# EAGLE design led-strip (EAGLE 5.07)
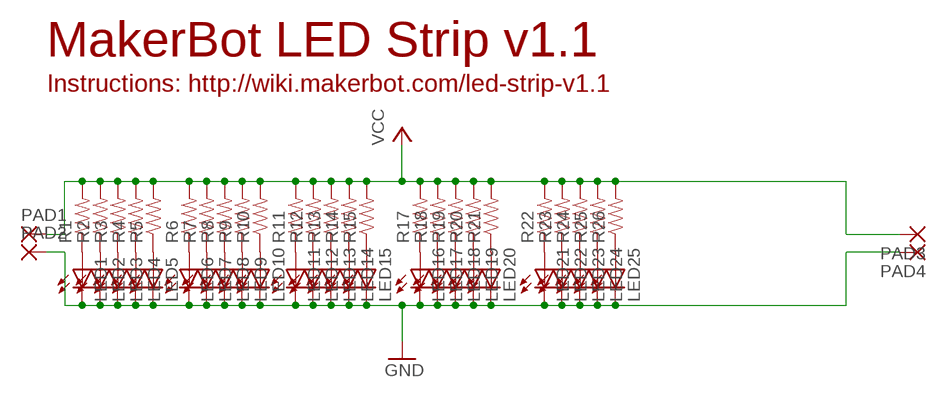
[diagram p0: schematic, sheet 1]

## Parts
LED1  LED1206  [LED-1206]
LED2  LED1206  [LED-1206]
LED3  LED1206  [LED-1206]
LED4  LED1206  [LED-1206]
LED5  LED1206  [LED-1206]
LED6  LED1206  [LED-1206]
LED7  LED1206  [LED-1206]
LED8  LED1206  [LED-1206]
LED9  LED1206  [LED-1206]
LED10  LED1206  [LED-1206]
LED11  LED1206  [LED-1206]
LED12  LED1206  [LED-1206]
LED13  LED1206  [LED-1206]
LED14  LED1206  [LED-1206]
LED15  LED1206  [LED-1206]
LED16  LED1206  [LED-1206]
LED17  LED1206  [LED-1206]
LED18  LED1206  [LED-1206]
LED19  LED1206  [LED-1206]
LED20  LED1206  [LED-1206]
LED21  LED1206  [LED-1206]
LED22  LED1206  [LED-1206]
LED23  LED1206  [LED-1206]
LED24  LED1206  [LED-1206]
LED25  LED1206  [LED-1206]
PAD1  SMD2  [SMD1,27-2,54]
PAD2  SMD2  [SMD1,27-2,54]
PAD3  SMD2  [SMD1,27-2,54]
PAD4  SMD2  [SMD1,27-2,54]
R1  RESISTOR1206  [1206]
R2  RESISTOR1206  [1206]
R3  RESISTOR1206  [1206]
R4  RESISTOR1206  [1206]
R5  RESISTOR1206  [1206]
R6  RESISTOR1206  [1206]
R7  RESISTOR1206  [1206]
R8  RESISTOR1206  [1206]
R9  RESISTOR1206  [1206]
R10  RESISTOR1206  [1206]
R11  RESISTOR1206  [1206]
R12  RESISTOR1206  [1206]
R13  RESISTOR1206  [1206]
R14  RESISTOR1206  [1206]
R15  RESISTOR1206  [1206]
R17  RESISTOR1206  [1206]
R18  RESISTOR1206  [1206]
R19  RESISTOR1206  [1206]
R20  RESISTOR1206  [1206]
R21  RESISTOR1206  [1206]
R22  RESISTOR1206  [1206]
R23  RESISTOR1206  [1206]
R24  RESISTOR1206  [1206]
R25  RESISTOR1206  [1206]
R26  RESISTOR1206  [1206]

## Nets
GND: LED1.C LED2.C LED3.C LED4.C LED5.C LED6.C LED7.C LED8.C LED9.C LED10.C LED11.C LED12.C LED13.C LED14.C LED15.C LED16.C LED17.C LED18.C LED19.C LED20.C LED21.C LED22.C LED23.C LED24.C LED25.C PAD2.1(P) PAD4.1(P)
N$1: LED1.A R1.1
N$2: LED2.A R2.1
N$3: LED3.A R3.1
N$4: LED4.A R4.1
N$5: LED5.A R5.1
N$6: LED6.A R6.1
N$7: LED7.A R7.1
N$8: LED8.A R8.1
N$9: LED9.A R9.1
N$10: LED10.A R10.1
N$11: LED11.A R11.1
N$12: LED12.A R12.1
N$13: LED13.A R13.1
N$14: LED14.A R14.1
N$15: LED15.A R15.1
N$16: LED16.A R17.1
N$17: LED17.A R18.1
N$18: LED18.A R19.1
N$19: LED19.A R20.1
N$20: LED20.A R21.1
N$21: LED21.A R22.1
N$22: LED22.A R23.1
N$23: LED23.A R24.1
N$24: LED24.A R25.1
N$25: LED25.A R26.1
VCC: PAD1.1(P) PAD3.1(P) R1.2 R2.2 R3.2 R4.2 R5.2 R6.2 R7.2 R8.2 R9.2 R10.2 R11.2 R12.2 R13.2 R14.2 R15.2 R17.2 R18.2 R19.2 R20.2 R21.2 R22.2 R23.2 R24.2 R25.2 R26.2

## Notes on the sheet
- MakerBot LED Strip v1.1
- Instructions: http://wiki.makerbot.com/led-strip-v1.1

## Library data of the parts
LED1-LED25 = SparkFun:LED: LEDs Standard schematic elements and footprints for 5mm, 3mm, 1206, and 0603 sized LEDs. 5mm - Spark Fun Electronics SKU : COM-00529 (and others)
PAD1-PAD4 = wirepad:SMD2: SMD PAD
R1-R15 R17-R26 = SparkFun:RESISTOR: Resistor Basic schematic elements and footprints for 0603, 1206, and PTH 1/10th watt (small) resistors.

## Net classes
0 default: width 0.889 mm, clearance 0.381 mm

## Board
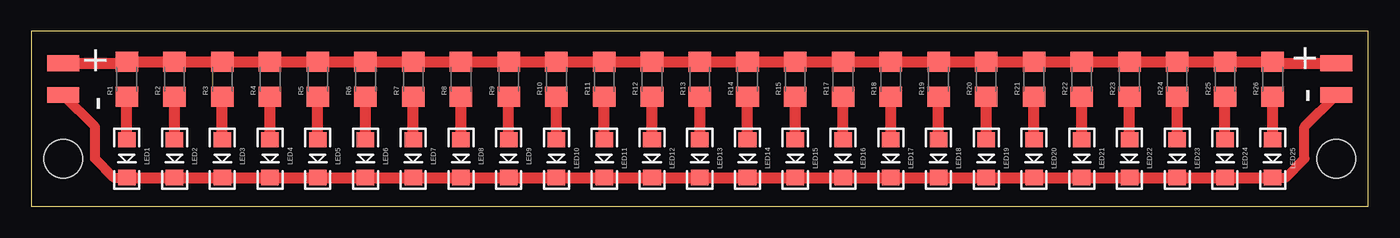
[diagram p1: board, top side]

Size 106.68 x 13.97 mm. Coordinates in mm from the lower left corner, seen from the top.
Outline: 0,0 106.68,0 106.68,13.97 0,13.97 0,0
Copper layers (1*16): Top 0.035mm / dielectric 1.5mm / Bottom 0.035mm
Design rules "default": minimum track width 10mil, minimum drill 24mil, track to track 8mil, track to pad 8mil, pad to pad 8mil, via to via 8mil, smd to smd 8mil, copper to edge 40mil, drill to drill 8mil, minimum pad ring 10mil, minimum via ring 8mil, stop-mask expansion 4mil, vias tented up to drill 0mil, thermal gap 10mil
Holes 3.1 mm at 2.54,3.81 104.14,3.81

### Footprints (pad centres in the part's own frame; a part is rotated, then mirrored left to right if it is on the bottom)
LED-1206 = smd 1.2 x 1.4: A -1.5,0; C 1.5,0
SMD1,27-2,54 = smd 1.27 x 2.54: 1 0,0
1206 = smd 1.6 x 1.8: 1 -1.4,0; 2 1.4,0

### Placement (x,y rotation side)
LED1  7.62,3.81 270 top
LED2  11.43,3.81 270 top
LED3  15.24,3.81 270 top
LED4  19.05,3.81 270 top
LED5  22.86,3.81 270 top
LED6  26.67,3.81 270 top
LED7  30.48,3.81 270 top
LED8  34.29,3.81 270 top
LED9  38.1,3.81 270 top
LED10  41.91,3.81 270 top
LED11  45.72,3.81 270 top
LED12  49.53,3.81 270 top
LED13  53.34,3.81 270 top
LED14  57.15,3.81 270 top
LED15  60.96,3.81 270 top
LED16  64.77,3.81 270 top
LED17  68.58,3.81 270 top
LED18  72.39,3.81 270 top
LED19  76.2,3.81 270 top
LED20  80.01,3.81 270 top
LED21  83.82,3.81 270 top
LED22  87.63,3.81 270 top
LED23  91.44,3.81 270 top
LED24  95.25,3.81 270 top
LED25  99.06,3.81 270 top
PAD1  104.14,11.43 90 top
PAD2  2.54,8.89 90 top
PAD3  2.54,11.43 90 top
PAD4  104.14,8.89 90 top
R1  7.62,10.16 90 top
R2  11.43,10.16 90 top
R3  15.24,10.16 90 top
R4  19.05,10.16 90 top
R5  22.86,10.16 90 top
R6  26.67,10.16 90 top
R7  30.48,10.16 90 top
R8  34.29,10.16 90 top
R9  38.1,10.16 90 top
R10  41.91,10.16 90 top
R11  45.72,10.16 90 top
R12  49.53,10.16 90 top
R13  53.34,10.16 90 top
R14  57.15,10.16 90 top
R15  60.96,10.16 90 top
R17  64.77,10.16 90 top
R18  68.58,10.16 90 top
R19  72.39,10.16 90 top
R20  76.2,10.16 90 top
R21  80.01,10.16 90 top
R22  83.82,10.16 90 top
R23  87.63,10.16 90 top
R24  91.44,10.16 90 top
R25  95.25,10.16 90 top
R26  99.06,10.16 90 top

### Tracks (layer width: path | path; a pad name or v marks a point on that pad's centre or on a via)
GND
  Top 0.813: LED1.C 6.58,2.31 5.08,3.81 5.08,6.35 PAD2.1 | LED25.C 100.1,2.31 101.6,3.81 101.6,6.35 PAD4.1
  Top 0.889: LED1.C 7.62,2.29 11.43,2.29 LED2.C 11.81,2.29 15.24,2.29 LED3.C 15.62,2.29 19.05,2.29 LED4.C 19.43,2.29 22.86,2.29 LED5.C 23.24,2.29 26.67,2.29 LED6.C 27.05,2.29 30.48,2.29 LED7.C 30.86,2.29 34.29,2.29 LED8.C 34.67,2.29 38.1,2.29 LED9.C 38.48,2.29 41.91,2.29 LED10.C 42.29,2.29 45.72,2.29 LED11.C 46.1,2.29 49.53,2.29 LED12.C 49.91,2.29 53.34,2.29 LED13.C 53.72,2.29 57.15,2.29 LED14.C 57.53,2.29 60.96,2.29 LED15.C 61.34,2.29 64.77,2.29 LED16.C 65.15,2.29 68.58,2.29 LED17.C 68.96,2.29 72.39,2.29 LED18.C 72.77,2.29 76.2,2.29 LED19.C 76.58,2.29 80.01,2.29 LED20.C 80.39,2.29 83.82,2.29 LED21.C 84.2,2.29 87.63,2.29 LED22.C 88.01,2.29 91.44,2.29 LED23.C 91.82,2.29 95.25,2.29 LED24.C 95.63,2.29 99.06,2.29 LED25.C
N$1
  Top 0.889: LED1.A R1.1
N$2
  Top 0.889: LED2.A R2.1
N$3
  Top 0.889: LED3.A R3.1
N$4
  Top 0.889: LED4.A R4.1
N$5
  Top 0.889: LED5.A R5.1
N$6
  Top 0.889: LED6.A R6.1
N$7
  Top 0.889: LED7.A R7.1
N$8
  Top 0.889: LED8.A R8.1
N$9
  Top 0.889: LED9.A R9.1
N$10
  Top 0.889: LED10.A R10.1
N$11
  Top 0.889: LED11.A R11.1
N$12
  Top 0.889: LED12.A R12.1
N$13
  Top 0.889: LED13.A R13.1
N$14
  Top 0.889: LED14.A R14.1
N$15
  Top 0.889: LED15.A R15.1
N$16
  Top 0.889: LED16.A R17.1
N$17
  Top 0.889: LED17.A R18.1
N$18
  Top 0.889: LED18.A R19.1
N$19
  Top 0.889: LED19.A R20.1
N$20
  Top 0.889: LED20.A R21.1
N$21
  Top 0.889: LED21.A R22.1
N$22
  Top 0.889: LED22.A R23.1
N$23
  Top 0.889: LED23.A R24.1
N$24
  Top 0.889: LED24.A R25.1
N$25
  Top 0.889: LED25.A R26.1
VCC
  Top 0.889: PAD3.1 7.24,11.43 R1.2 R2.2 11.81,11.56 R3.2 15.62,11.56 R4.2 19.43,11.56 R5.2 23.24,11.56 R6.2 27.05,11.56 R7.2 30.86,11.56 R8.2 34.67,11.56 R9.2 38.48,11.56 R10.2 42.29,11.56 R11.2 46.1,11.56 R12.2 49.91,11.56 R13.2 53.72,11.56 R14.2 57.53,11.56 R15.2 61.34,11.56 R17.2 65.15,11.56 R18.2 68.96,11.56 R19.2 72.77,11.56 R20.2 76.58,11.56 R21.2 80.39,11.56 R22.2 84.2,11.56 R23.2 88.01,11.56 R24.2 91.82,11.56 R25.2 95.63,11.56 R26.2 99.44,11.43 PAD1.1

### Text on the board
tPlace: + | + | - | -